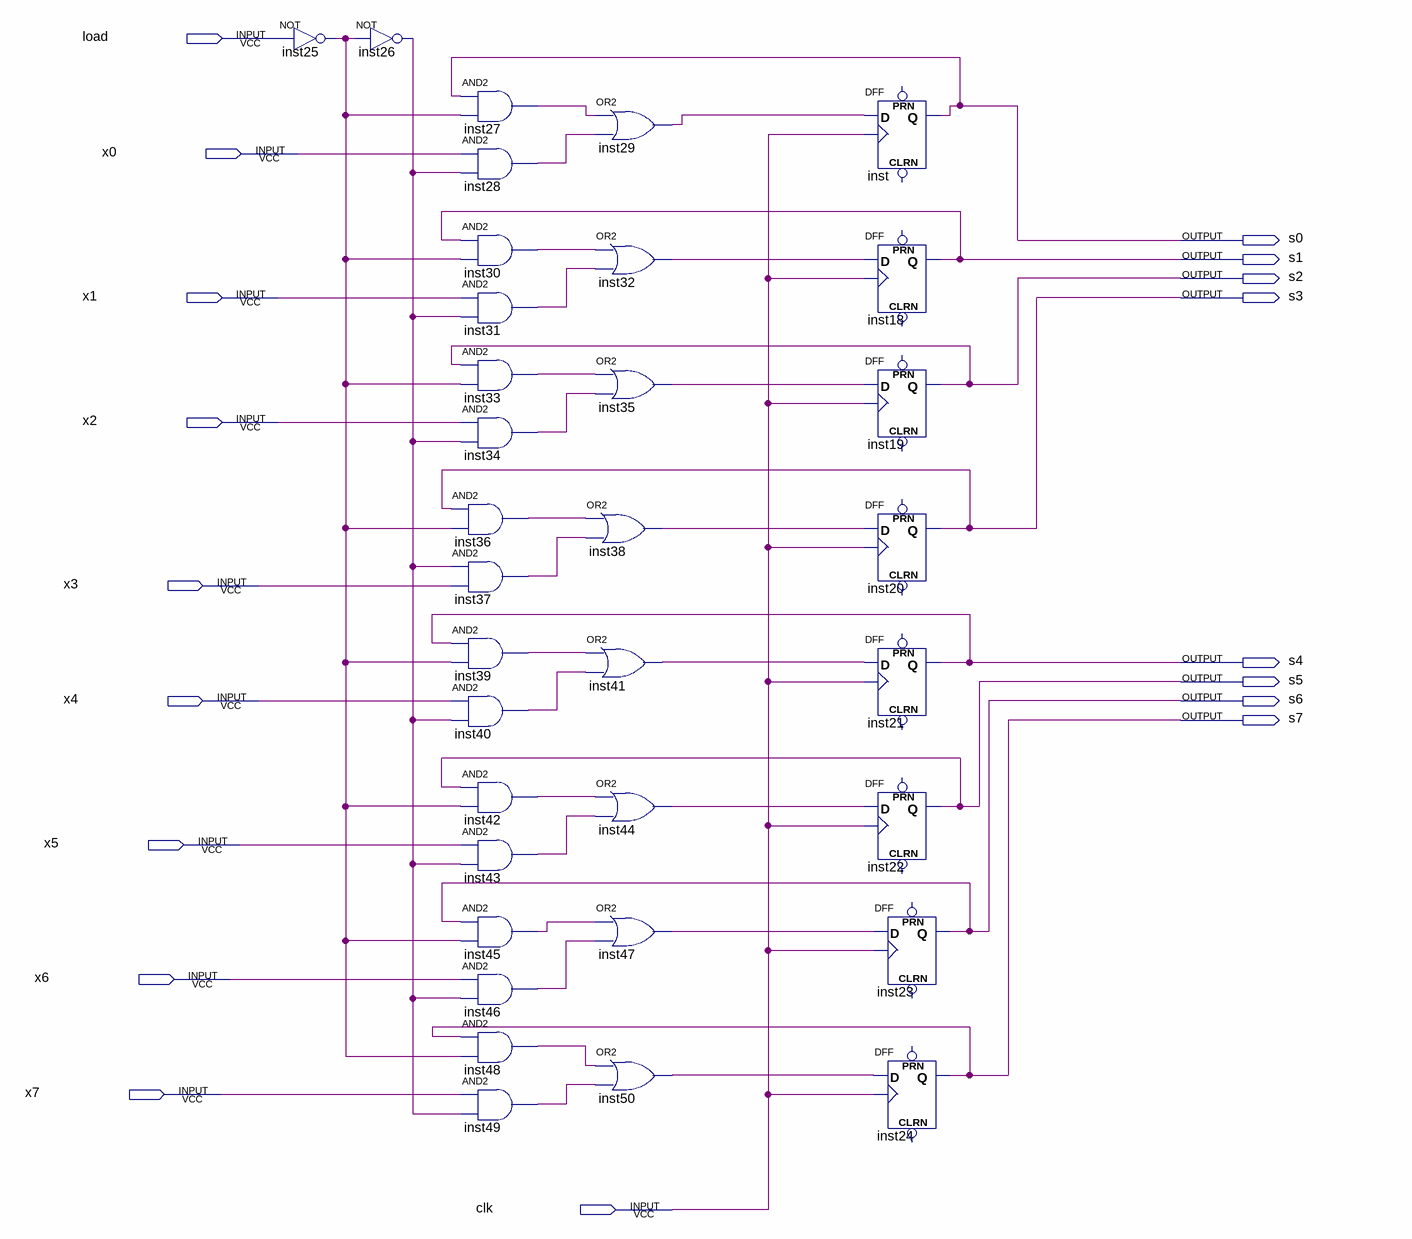
[diagram p0: schematic sheet]
// Quartus schematic redgister.bdf as structural Verilog: 34 symbols, 18 pins
module redgister (
  input  load,
  input  x0,
  input  x1,
  input  x2,
  input  x3,
  input  x4,
  input  x5,
  input  x6,
  input  x7,
  input  clk,
  output s0,
  output s1,
  output s2,
  output s3,
  output s4,
  output s5,
  output s6,
  output s7
);

  wire inst25_out, inst26_out, inst27_out, inst28_out, inst29_out, inst30_out, inst31_out, inst32_out,
       inst33_out, inst34_out, inst35_out, inst36_out, inst37_out, inst38_out, inst39_out, inst40_out,
       inst41_out, inst42_out, inst43_out, inst44_out, inst45_out, inst46_out, inst47_out, inst48_out,
       inst49_out, inst50_out;

  not inst25 (inst25_out, load);
  not inst26 (inst26_out, inst25_out);
  and inst27 (inst27_out, s0, inst25_out);
  and inst28 (inst28_out, x0, inst26_out);
  and inst30 (inst30_out, s1, inst25_out);
  and inst31 (inst31_out, x1, inst26_out);
  and inst33 (inst33_out, s2, inst25_out);
  and inst34 (inst34_out, x2, inst26_out);
  and inst36 (inst36_out, s3, inst25_out);
  and inst37 (inst37_out, inst26_out, x3);
  and inst39 (inst39_out, s4, inst25_out);
  and inst40 (inst40_out, x4, inst26_out);
  and inst42 (inst42_out, s5, inst25_out);
  and inst43 (inst43_out, x5, inst26_out);
  and inst45 (inst45_out, s6, inst25_out);
  and inst46 (inst46_out, x6, inst26_out);
  and inst48 (inst48_out, s7, inst25_out);
  and inst49 (inst49_out, x7, inst26_out);
  or inst29 (inst29_out, inst27_out, inst28_out);
  or inst32 (inst32_out, inst30_out, inst31_out);
  or inst35 (inst35_out, inst33_out, inst34_out);
  or inst38 (inst38_out, inst36_out, inst37_out);
  or inst41 (inst41_out, inst39_out, inst40_out);
  or inst44 (inst44_out, inst42_out, inst43_out);
  or inst47 (inst47_out, inst45_out, inst46_out);
  or inst50 (inst50_out, inst48_out, inst49_out);
  DFF inst (.CLK(clk), .D(inst29_out), .Q(s0));  // open: CLRN, PRN
  DFF inst18 (.CLK(clk), .D(inst32_out), .Q(s1));  // open: CLRN, PRN
  DFF inst19 (.CLK(clk), .D(inst35_out), .Q(s2));  // open: CLRN, PRN
  DFF inst20 (.CLK(clk), .D(inst38_out), .Q(s3));  // open: CLRN, PRN
  DFF inst21 (.CLK(clk), .D(inst41_out), .Q(s4));  // open: CLRN, PRN
  DFF inst22 (.CLK(clk), .D(inst44_out), .Q(s5));  // open: CLRN, PRN
  DFF inst23 (.CLK(clk), .D(inst47_out), .Q(s6));  // open: CLRN, PRN
  DFF inst24 (.CLK(clk), .D(inst50_out), .Q(s7));  // open: CLRN, PRN
endmodule
